# EAGLE design ncp-1117-inverted (EAGLE 6.3)
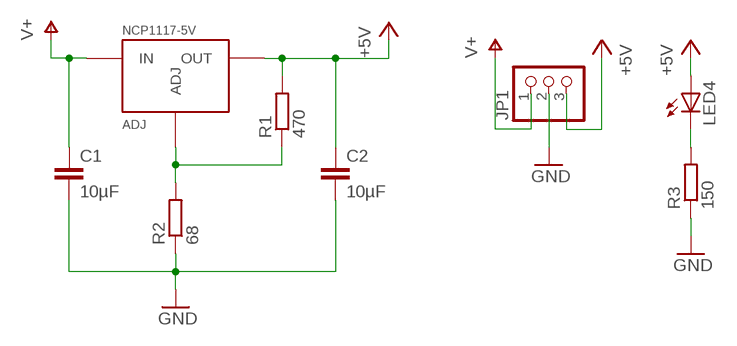
[diagram p0: schematic, sheet 1]

## Parts
C1  10µF  C-EUC0805  [C0805]
C2  10µF  C-EUC0805  [C0805]
JP1  PINHD-1X3  [1X03]
LED4  LEDCHIP-LED0603  [CHIP-LED0603]
NCP1117-5V  ADJ  REGULATOR-TLV1117TO-252  [TO252]
R1  470  R-EU_R0603  [R0603]
R2  68  R-EU_R0603  [R0603]
R3  150  R-EU_R0603  [R0603]

## Nets
+5V: C2.1 JP1.3 LED4.A NCP1117-5V.3(OUT) R1.2
GND: C1.2 C2.2 JP1.2 R2.1 R3.1
N$1: LED4.C R3.2
N$11: NCP1117-5V.1(ADJ) R1.1 R2.2
V+: C1.1 JP1.1 NCP1117-5V.2(IN)

## Library data of the parts
C1 C2 = p.peter-rcl:C-EU: CAPACITOR, European symbol
JP1 = pinhead:PINHD-1X3: PIN HEADER
LED4 = led:LED: LED OSRAM: - CHIPLED LG R971, LG N971, LY N971, LG Q971, LY Q971, LO R971, LY R971 LH N974, LH R974 LS Q976, LO Q976, LY Q976 LO Q996 - Hyper CHIPLED LW Q18S LB Q993, LB Q99A, LB R99A - SideLED LS A670, LO A670, LY A670, LG A670, LP A670 LB A673, LV A673, LT A673, LW A673 LH A674 LY A675 LS A676, LA A676, LO A676, LY A676, LW A676 LS A679, LY A679, LG A679 - Hyper Micro SIDELED® LS Y876, LA Y876, LO Y876, LY Y876 LT Y87S - SmartLED LW L88C, LW L88S LB L89C, LB L89S, LG L890 LS L89K, LO L89K, LY L89K LS L896, LA L896, LO L896, LY L896 - TOPLED LS T670, LO T670, LY T670, LG T670, LP T670 LSG T670, LSP T670, LSY T670, LOP T670, LYG T670 LG T671, LOG T671, LSG T671 LB T673, LV T673, LT T673, LW T673 LH T674 LS T676, LA T676, LO T676, LY T676, LB T676, LH T676, LSB T676, LW T676 LB T67C, LV T67C, LT T67C, LS T67K, LO T67K, LY T67K, LW E67C LS E67B, LA E67B, LO E67B, LY E67B, LB E67C, LV E67C, LT E67C LW T67C LS T679, LY T679, LG T679 LS T770, LO T770, LY T770, LG T770, LP T770 LB T773, LV T773, LT T773, LW T773 LH T774 LS E675, LA E675, LY E675, LS T675 LS T776, LA T776, LO T776, LY T776, LB T776 LHGB T686 LT T68C, LB T68C - Hyper Mini TOPLED® LB M676 - Mini TOPLED Santana® LG M470 LS M47K, LO M47K, LY M47K Source: http://www.osram.convergy.de LUXEON: - LUMILED® LXK2-PW12-R00, LXK2-PW12-S00, LXK2-PW14-U00, LXK2-PW14-V00 LXK2-PM12-R00, LXK2-PM12-S00, LXK2-PM14-U00 LXK2-PE12-Q00, LXK2-PE12-R00, LXK2-PE12-S00, LXK2-PE14-T00, LXK2-PE14-U00 LXK2-PB12-K00, LXK2-PB12-L00, LXK2-PB12-M00, LXK2-PB14-N00, LXK2-PB14-P00, LXK2-PB14-Q00 LXK2-PR12-L00, LXK2-PR12-M00, LXK2-PR14-Q00, LXK2-PR14-R00 LXK2-PD12-Q00, LXK2-PD12-R00, LXK2-PD12-S00 LXK2-PH12-R00, LXK2-PH12-S00 LXK2-PL12-P00, LXK2-PL12-Q00, LXK2-PL12-R00 Source: www.luxeon.com KINGBRIGHT: KA-3528ASYC Source: www.kingbright.com
NCP1117-5V = p.peter-regulators:REGULATOR-TLV1117
R1-R3 = p.peter-rcl:R-EU_: RESISTOR, European symbol

## Board
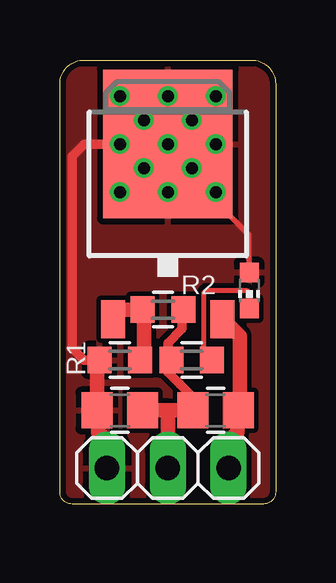
[diagram p1: board, top side]
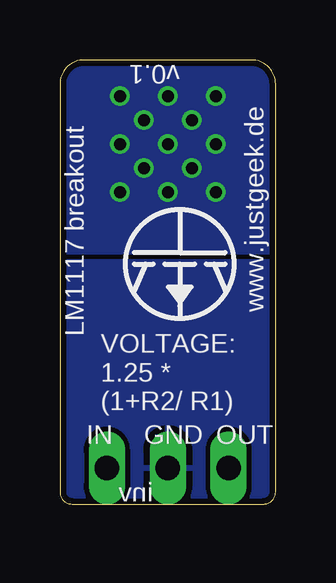
[diagram p2: board, bottom side, seen from below]

Size 9 x 18.5 mm. Coordinates in mm from the lower left corner, seen from the top.
Outline: 0.5,0 arc-90 0,0.5 0,17.5 arc-90 1,18.5 8,18.5 arc-90 9,17.5 9,0.5 arc-90 8.5,0 0.5,0
Copper layers (1*16): Top 0.035mm / dielectric 1.5mm / Bottom 0.035mm
Design rules "Fusion_eagle_rule_v1.1 *": minimum track width 6mil, minimum drill 12mil, track to track 6mil, track to pad 6mil, pad to pad 6mil, via to via 6mil, smd to smd 0mil, copper to edge 10mil, drill to drill 10mil, minimum pad ring 10mil, minimum via ring 6mil, stop-mask expansion 2mil, vias tented up to drill 100mil, thermal gap 10mil

### Footprints (pad centres in the part's own frame; a part is rotated, then mirrored left to right if it is on the bottom)
C0805 = smd 1.3 x 1.5: 1 -0.95,0; 2 0.95,0
1X03 = drill 1.016 long: 1 -2.54,0; 2 0,0; 3 2.54,0
CHIP-LED0603 = smd 0.8 x 0.8: A 0,-0.75; C 0,0.75
TO252 = smd 1 x 1.6: 1 -2.28,-4.8; 2 2.28,-4.8 | smd 5.4 x 6.2: 3 0,2.5
R0603 = smd 1 x 1.1: 1 -0.85,0; 2 0.85,0

### Placement (x,y rotation side)
C1  6.5,3.9 180 top
C2  2.5,3.9 0 top
JP1  4.5,1.5 180 top
LED4  7.9,8.9 180 top
NCP1117-5V  4.5,12.5 0 top
R1  2.5,6 180 top
R2  4.3,8.1 180 top
R3  5.5,6 0 top
U$1  [LOGO-JUSTGEEK-XS]  4,10 0 bottom

### Tracks (layer width: path | path; a pad name or v marks a point on that pad's centre or on a via)
+5V  (via drill 0.5)
  Top 0.2: NCP1117-5V.3 v4.5,17 | LED4.A 7.9,11.2 6.8,12.3 6.8,12.4 4.2,15
  Top 0.4: JP1.3 2,1.5 | 1.6,3.95 C2.1 | NCP1117-5V.3 4.2,15 1,15 0.5,14.5 0.5,11.5 | 0.5,11.5 0.5,11 | 1.55,5.9 R1.2 1.5,6 1,6 0.5,6.5 0.5,11 | 0.5,11 0.5,11.5
  Top 0.6: 2,1.5 2,2.6 1.6,3 1.6,3.95 | C2.1 1.55,5.9
  other vias: 2.5,17 6.5,17 5.5,16 3.5,16 2.5,15 4.5,15 6.5,15 5.5,14 3.5,14 2.5,13 4.5,13 6.5,13
  pour Bottom (isolate 0.2): 0,18.5 0,10.5 9,10.5 9,18.5
  pour Top (isolate 0.2): 8,18.5 1,18.5 1,11.5 1.5,11 7.5,11 8,11.5
  pour Top (isolate 0.2): 0,0 0,18.5 9,18.5 9,0
GND
  Top 0.4: 5.5,3.9 C1.2 | C1.2 5.5,3.9 | C1.2 5.5,3.9 | 5.5,3.9 5.5,4.5 5,5 4.5,5.5 4.5,5.85 R3.1 4.5,6 4.5,6.7 5.1,7.3 5.1,8.05 R2.1
  Top 0.6: JP1.2 4.5,3.9 | 4.5,3.9 C2.2 | 4.5,3.9 5.5,3.9
  pour Bottom (isolate 0.2, rank 2): 9,0 0,0 0,10.5 9,10.5
N$1
  Top 0.2: R3.2 6.35,6.05 6,6.4 6,8.8 6.1,8.9 7.8,8.9 7.9,8.8 LED4.C
N$11
  Top 0.4: 2.2,8.1 2.22,7.92 NCP1117-5V.1 2.32,8.1 | 3.5,8 R2.2 3.5,8 | 3.5,6.15 R1.1 3.5,6.15
  Top 0.6: 3.5,8 3.5,6.15 | R2.2 2.32,8.1
V+
  Top 0.4: JP1.1 7,1.5 7,1.6 | 7.4,3.95 C1.1 7.1,4 7,4.1 7.4,4.1 7.5,4 | 7,7.5 6.98,8 NCP1117-5V.2
  Top 0.6: 7,1.6 7,2.6 7.4,3 7.4,3.95 | 7.5,4 7.5,7 7,7.5

### Text on the board
bPlace: v0.1 | www.justgeek.de | LM1117 breakout | VOLTAGE: / 1.25 * / (1+R2/ R1) | OUT | GND | IN | inv